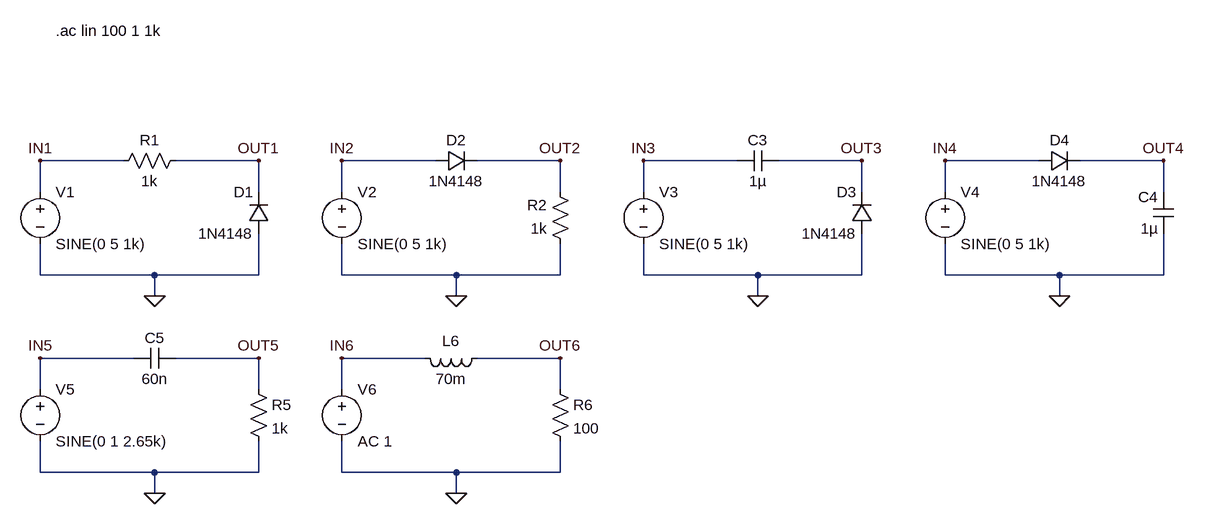
[diagram p0: schematic activity-1.asc]
activity-1.asc, the LTspice schematic file:
Version 4.1
SHEET 1 1616 680
WIRE -32 -416 -160 -416
WIRE 176 -416 48 -416
WIRE 448 -416 304 -416
WIRE 640 -416 512 -416
WIRE 912 -416 768 -416
WIRE 1104 -416 976 -416
WIRE 1376 -416 1232 -416
WIRE 1568 -416 1440 -416
WIRE -160 -368 -160 -416
WIRE 176 -368 176 -416
WIRE 304 -368 304 -416
WIRE 640 -368 640 -416
WIRE 768 -368 768 -416
WIRE 1104 -368 1104 -416
WIRE 1232 -368 1232 -416
WIRE 1568 -368 1568 -416
WIRE -160 -240 -160 -288
WIRE 16 -240 -160 -240
WIRE 176 -240 176 -304
WIRE 176 -240 16 -240
WIRE 304 -240 304 -288
WIRE 480 -240 304 -240
WIRE 640 -240 640 -288
WIRE 640 -240 480 -240
WIRE 768 -240 768 -288
WIRE 944 -240 768 -240
WIRE 1104 -240 1104 -304
WIRE 1104 -240 944 -240
WIRE 1232 -240 1232 -288
WIRE 1408 -240 1232 -240
WIRE 1568 -240 1568 -304
WIRE 1568 -240 1408 -240
WIRE 16 -208 16 -240
WIRE 480 -208 480 -240
WIRE 944 -208 944 -240
WIRE 1408 -208 1408 -240
WIRE -16 -112 -160 -112
WIRE 176 -112 48 -112
WIRE 432 -112 304 -112
WIRE 640 -112 512 -112
WIRE -160 -64 -160 -112
WIRE 176 -64 176 -112
WIRE 304 -64 304 -112
WIRE 640 -64 640 -112
WIRE -160 64 -160 16
WIRE 16 64 -160 64
WIRE 176 64 176 16
WIRE 176 64 16 64
WIRE 304 64 304 16
WIRE 480 64 304 64
WIRE 640 64 640 16
WIRE 640 64 480 64
WIRE 16 96 16 64
WIRE 480 96 480 64
FLAG 16 -208 0
FLAG -160 -416 IN1
FLAG 176 -416 OUT1
FLAG 480 -208 0
FLAG 304 -416 IN2
FLAG 640 -416 OUT2
FLAG 768 -416 IN3
FLAG 1104 -416 OUT3
FLAG 944 -208 0
FLAG 1408 -208 0
FLAG 1232 -416 IN4
FLAG 1568 -416 OUT4
FLAG 16 96 0
FLAG -160 -112 IN5
FLAG 176 -112 OUT5
FLAG 480 96 0
FLAG 304 -112 IN6
FLAG 640 -112 OUT6
SYMBOL res 64 -432 R90
WINDOW 0 0 56 VBottom 2
WINDOW 3 32 56 VTop 2
SYMATTR InstName R1
SYMATTR Value 1k
SYMBOL diode 192 -304 R180
WINDOW 0 24 64 Left 2
WINDOW 3 24 0 Left 2
SYMATTR InstName D1
SYMATTR Value 1N4148
SYMBOL voltage -160 -384 R0
WINDOW 123 0 0 Left 0
WINDOW 39 0 0 Left 0
SYMATTR InstName V1
SYMATTR Value SINE(0 5 1k)
SYMBOL res 656 -272 R180
WINDOW 0 36 76 Left 2
WINDOW 3 36 40 Left 2
SYMATTR InstName R2
SYMATTR Value 1k
SYMBOL diode 448 -400 R270
WINDOW 0 32 32 VTop 2
WINDOW 3 0 32 VBottom 2
SYMATTR InstName D2
SYMATTR Value 1N4148
SYMBOL voltage 304 -384 R0
WINDOW 123 0 0 Left 0
WINDOW 39 0 0 Left 0
SYMATTR InstName V2
SYMATTR Value SINE(0 5 1k)
SYMBOL diode 1120 -304 R180
WINDOW 0 24 64 Left 2
WINDOW 3 24 0 Left 2
SYMATTR InstName D3
SYMATTR Value 1N4148
SYMBOL voltage 768 -384 R0
WINDOW 123 0 0 Left 0
WINDOW 39 0 0 Left 0
SYMATTR InstName V3
SYMATTR Value SINE(0 5 1k)
SYMBOL cap 976 -432 R90
WINDOW 0 0 32 VBottom 2
WINDOW 3 32 32 VTop 2
SYMATTR InstName C3
SYMATTR Value 1µ
SYMBOL diode 1376 -400 R270
WINDOW 0 32 32 VTop 2
WINDOW 3 0 32 VBottom 2
SYMATTR InstName D4
SYMATTR Value 1N4148
SYMBOL voltage 1232 -384 R0
WINDOW 123 0 0 Left 0
WINDOW 39 0 0 Left 0
SYMATTR InstName V4
SYMATTR Value SINE(0 5 1k)
SYMBOL cap 1584 -304 R180
WINDOW 0 24 56 Left 2
WINDOW 3 24 8 Left 2
SYMATTR InstName C4
SYMATTR Value 1µ
SYMBOL voltage -160 -80 R0
WINDOW 123 0 0 Left 0
WINDOW 39 0 0 Left 0
SYMATTR InstName V5
SYMATTR Value SINE(0 1 2.65k)
SYMBOL cap 48 -128 R90
WINDOW 0 0 32 VBottom 2
WINDOW 3 32 32 VTop 2
SYMATTR InstName C5
SYMATTR Value 60n
SYMBOL res 160 -80 R0
SYMATTR InstName R5
SYMATTR Value 1k
SYMBOL voltage 304 -80 R0
WINDOW 123 0 0 Left 0
WINDOW 39 0 0 Left 0
SYMATTR InstName V6
SYMATTR Value AC 1
SYMBOL res 624 -80 R0
SYMATTR InstName R6
SYMATTR Value 100
SYMBOL ind 528 -128 R90
WINDOW 0 5 56 VBottom 2
WINDOW 3 32 56 VTop 2
SYMATTR InstName L6
SYMATTR Value 70m
SYMATTR SpiceLine Rser=1m
TEXT -136 -616 Left 2 !.ac lin 100 1 1k

The netlist it stands for:
* activity-1.asc
R1 OUT1 IN1 1k
D1 0 OUT1 1N4148
V1 IN1 0 SINE(0 5 1k)
R2 0 OUT2 1k
D2 IN2 OUT2 1N4148
V2 IN2 0 SINE(0 5 1k)
D3 0 OUT3 1N4148
V3 IN3 0 SINE(0 5 1k)
C3 OUT3 IN3 1µ
D4 IN4 OUT4 1N4148
V4 IN4 0 SINE(0 5 1k)
C4 0 OUT4 1µ
V5 IN5 0 SINE(0 1 2.65k)
C5 OUT5 IN5 60n
R5 OUT5 0 1k
V6 IN6 0 AC 1
R6 OUT6 0 100
L6 OUT6 IN6 70m Rser=1m
.model D D
.lib standard.dio
.ac lin 100 1 1k
.backanno
.end